# Altium project Board1_module.PrjPCB
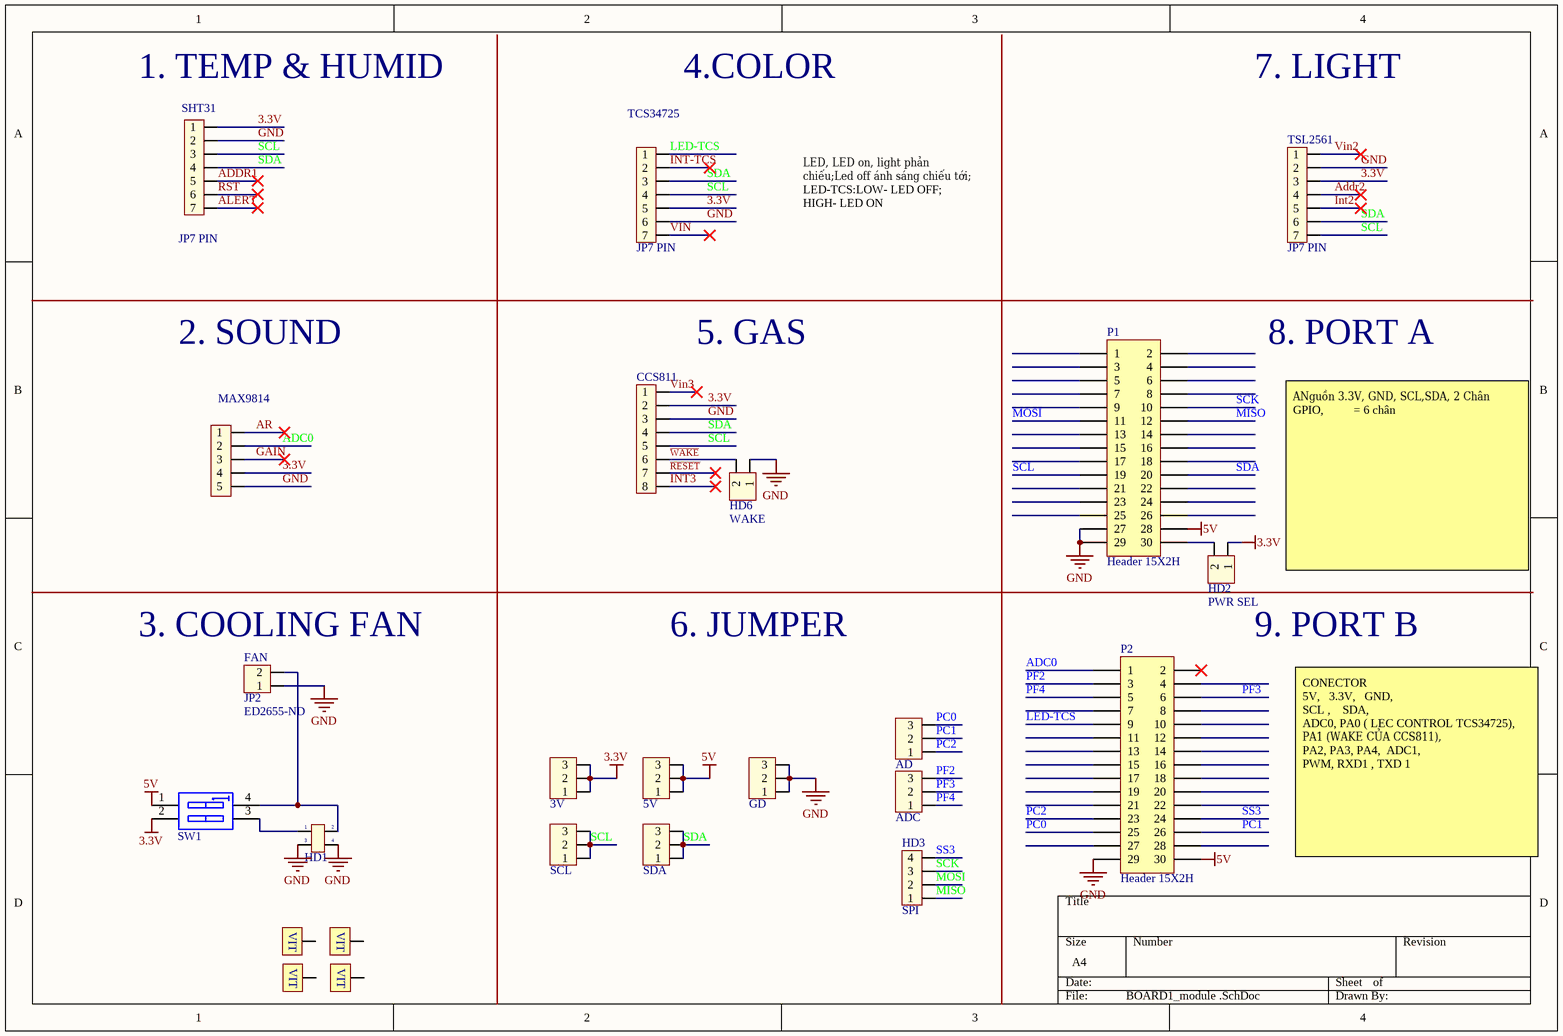
[diagram p0: BOARD1_module .SchDoc]
1 sheet, 24 parts. Net scope: global (net labels, ports and power ports of the same name join across sheets).
Board file: Board1_module.PcbDoc

## Sheet BOARD1_module .SchDoc
size A4

### Parts
3V  Header 3  [Header_3]  (value not drawn)
5V  Header 3  [Header_3]  (value not drawn)
AD  Header 3  [Header_3]  (value not drawn)
ADC  Header 3  [Header_3]  (value not drawn)
CCS811  JP8 PIN  [CCS811]  (value not drawn)
FAN  JP2  Supplier Part Number 1: ED2655-ND  [CON2]
GD  Header 3  [Header_3]  (value not drawn)
HD1  Jumper 2x2  [HDR2X2]  (value not drawn)
HD2  PWR SEL  [Header_2]
HD3  SPI  [Header_4]
HD6  WAKE  [Header_2]
MAX9814  JP5  [MAX9814]  (value not drawn)
P1  Header 15X2H  [HED15X2H]
P2  Header 15X2H  [HED15X2H]
SCL  Header 3  [Header_3]  (value not drawn)
SDA  Header 3  [Header_3]  (value not drawn)
SHT31  JP7 PIN  [SHT31]
SW1  SW - DIP2  [DIP_Switch2]  (value not drawn)
TCS34725  JP7 PIN  [TCS34725]
TSL2561  JP7 PIN  [TSL2561]
VIT2  1  [Screw 3 small]  (value not drawn)
VIT3  1  [Screw 3 small]  (value not drawn)
VIT5  1  [Screw 3 small]  (value not drawn)
VIT6  1  [Screw 3 small]  (value not drawn)

### Nets
3.3V: 3V.1 3V.2 3V.3 CCS811.2 HD2.1 MAX9814.4 SHT31.1 SW1.2(A2) TCS34725.5 TSL2561.3
5V: 5V.1 5V.2 5V.3 P1.28 P2.30 SW1.1(A1)
GND: CCS811.3 FAN.1 GD.1 GD.2 GD.3 HD1.3 HD1.4 HD6.1 MAX9814.5 P1.27 P1.29 P2.29 SHT31.2 TCS34725.6 TSL2561.2
~{WAKE}: CCS811.6 HD6.2
ADC0: MAX9814.2 P2.1
ADDR1: SHT31.5
Addr2: TSL2561.4
ALERT: SHT31.7
AR: MAX9814.1
GAIN: MAX9814.3
Int2: TSL2561.5
INT3: CCS811.8
INT-TCS: TCS34725.2
LED-TCS: P2.9 TCS34725.1
MISO: HD3.1 P1.12
MOSI: HD3.2 P1.11
PC0: AD.3 P2.25
PC1: AD.2 P2.26
PC2: AD.1 P2.23
PF2: ADC.3 P2.3
PF3: ADC.2 P2.6
PF4: ADC.1 P2.5
~{RESET}: CCS811.7
RST: SHT31.6
SCK: HD3.3 P1.10
SCL: CCS811.5 P1.19 SCL.1 SCL.2 SCL.3 SHT31.3 TCS34725.4 TSL2561.7
SDA: CCS811.4 P1.20 SDA.1 SDA.2 SDA.3 SHT31.4 TCS34725.3 TSL2561.6
SS3: HD3.4 P2.24
VIN: TCS34725.7
Vin2: TSL2561.1
Vin3: CCS811.1
NetFAN_2: FAN.2 HD1.2 SW1.4(A4)
NetHD1_1: HD1.1 SW1.3(A3)
NetHD2_2: HD2.2 P1.30

Not connected (* = marked no-connect by the designer): P1 1 2 3 4 5 6 7 8 9 13 14 15 16 17 18 21 22 23 24 25 26; P2 2* 4 7 8 10 11 12 13 14 15 16 17 18 19 20 21 22 27 28; VIT2 VIT1(1); VIT3 VIT1(1); VIT5 VIT1(1); VIT6 VIT1(1)

### Notes on the sheet
- (near SHT31) 1. TEMP & HUMID
- 4.COLOR
- 7. LIGHT
- LED, LED on, light phản chiếu;Led off ánh sáng chiếu tới; LED-TCS:LOW- LED OFF; HIGH- LED ON
- 2. SOUND
- 5. GAS
- 8. PORT A
- ANguồn 3.3V, GND, SCL,SDA, 2 Chân GPIO,          = 6 chân
- (near FAN) 3. COOLING FAN
- 6. JUMPER
- 9. PORT B
- CONECTOR                                                       5V,   3.3V,   GND,                                                        SCL ,    SDA,                                                       ADC0, PA0 ( LEC CONTROL TCS34725),      PA1 (WAKE CỦA CCS811),                             PA2, PA3, PA4,  ADC1,                             PWM, RXD1 , TXD 1

### Library data of the parts
3V 5V AD ADC GD SCL SDA = Header3: Value: Header 3
CCS811 = JP8: Value: JP7
FAN = Terminal 2: Terminal 2pin 5mm; Manufacturer: On Shore Technology Inc.; Manufacturer Part Number: OSTTH020160; Value: Terminal Block 2-pin 5mm Screw; Cost (VN): 1500; Number of Positions: 2; Pitch: 0.197" (5.00mm); Voltage - UL: 300V; Wire Gauge or Range - AWG: 14-22 AWG; Wire Gauge or Range - mm²: 0.34-1.5mm²; Material Flammability Rating: UL94 V-0; Torque - Screw: 0.4 Nm (3.5 Lb-In); Wire Strip Length: 5-6mm; BuyLink: http://www.tme.vn/Product.aspx?id=857#page=pro_info; Supplier 1: Digi-Key; RoHS: RoHS Compliant; Category: Connectors, Interconnects; Stock 1: 43547; Pricing 1: 1=0.58, 10=0.546, 50=0.4368, 100=0.4186, 250=0.3822, 500=0.364, 1000=0.3003, 2500=0.273, 5000=0.2639 (USD); Packaging: Bulk; Part Status: Active; Type: Plug for Unshrouded Header; Positions Per Level: 2; Number of Levels: 2; Header Orientation: -; Plug Wire Entry: -; Termination Style: Screw; Mounting Type: Screw; Current - IEC: -; Voltage - IEC: -; Current - UL: -; Color: Blue; Operating Temperature: -40°C ~ 115°C; Contact Mating Finish: Nickel; Features: Interlocking (Side); Ingress Protection: -; Screw Size: -; Contact Material: Brass; Housing Material: Brass; Contact Tail Length: -; Insulation Height: -; ComponentLink1URL: http://www.on-shore.com/wp-content/uploads/2015/09/ostthxx0160.pdf; ComponentLink1Description: http://www.on-shore.com/wp-content/uploads/2015/09/ostthxx0160.pdf
HD1 = JP2x2: Value: JP 2x2
HD2 HD6 = Header2: Header 2; Value: Header 2
HD3 = Header4: Header 4; Value: Header 4
P1 P2 = Header 15X2H: Header, 15-Pin, Dual row, Right Angle; LatestRevisionDate: 17-Jul-2002; LatestRevisionNote: Re-released for DXP Platform.; Publisher: Altium Limited
SHT31 TCS34725 TSL2561 = JP7: Value: JP7
SW1 = SWDIP-2: DIP Switch, 2 Position, SPST; Value: SW - DIP2
VIT2 VIT3 VIT5 VIT6 = VIT: Oc Vit